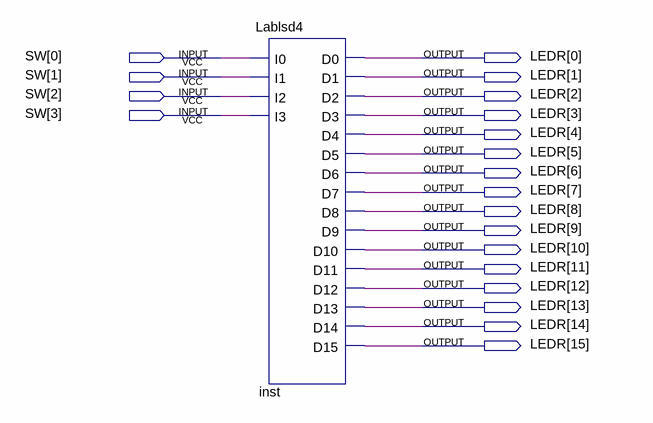
[diagram p0: schematic sheet]
// Quartus schematic Blockleds.bdf as structural Verilog: 1 symbols, 20 pins
module Blockleds (
  input  [3:0] SW,
  output [15:0] LEDR
);

  Lablsd4 inst (
    .I0(SW[0]), .I1(SW[1]), .I2(SW[2]), .I3(SW[3]), .D0(LEDR[0]), .D1(LEDR[1]), .D2(LEDR[2]), .D3(LEDR[3]),
    .D4(LEDR[4]), .D5(LEDR[5]), .D6(LEDR[6]), .D7(LEDR[7]), .D8(LEDR[8]), .D9(LEDR[9]), .D10(LEDR[10]),
    .D11(LEDR[11]), .D12(LEDR[12]), .D13(LEDR[13]), .D14(LEDR[14]), .D15(LEDR[15]));
endmodule
